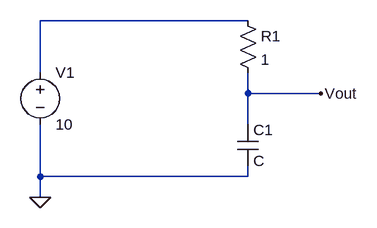
[diagram p0: schematic Draft3.asc]
Draft3.asc, the LTspice schematic file:
Version 4
SHEET 1 880 680
WIRE 288 160 -32 160
WIRE -32 240 -32 160
WIRE 288 272 288 240
WIRE 400 272 288 272
WIRE 288 320 288 272
WIRE -32 400 -32 320
WIRE 288 400 288 384
WIRE 288 400 -32 400
WIRE -32 432 -32 400
FLAG -32 432 0
FLAG 400 272 Vout
SYMBOL res 272 144 R0
SYMATTR InstName R1
SYMATTR Value 1
SYMBOL voltage -32 224 R0
WINDOW 123 0 0 Left 0
WINDOW 39 0 0 Left 0
SYMATTR InstName V1
SYMATTR Value 10
SYMBOL cap 272 320 R0
SYMATTR InstName C1

The netlist it stands for:
* Draft3.asc
R1 N001 Vout 1
V1 N001 0 10
C1 Vout 0 C
.backanno
.end